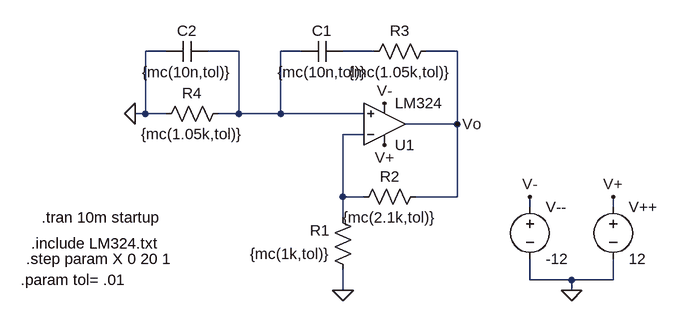
[diagram p0: schematic Lab4Circ2.asc]
Lab4Circ2.asc, the LTspice schematic file:
Version 4
SHEET 1 1424 680
WIRE -128 48 -160 48
WIRE -16 48 -64 48
WIRE 80 48 48 48
WIRE 192 48 144 48
WIRE 320 48 272 48
WIRE -160 144 -160 48
WIRE -160 144 -176 144
WIRE -128 144 -160 144
WIRE -16 144 -16 48
WIRE -16 144 -48 144
WIRE 48 144 48 48
WIRE 48 144 -16 144
WIRE 176 144 48 144
WIRE 320 160 320 48
WIRE 320 160 240 160
WIRE 176 176 144 176
WIRE 144 272 144 176
WIRE 176 272 144 272
WIRE 320 272 320 160
WIRE 320 272 256 272
WIRE 432 288 432 272
WIRE 560 288 560 272
WIRE 144 304 144 272
WIRE 432 400 432 368
WIRE 496 400 432 400
WIRE 560 400 560 368
WIRE 560 400 496 400
WIRE 144 416 144 384
WIRE 496 416 496 400
FLAG 496 416 0
FLAG 560 272 V+
FLAG 208 192 V+
FLAG 432 272 V-
FLAG 208 128 V-
FLAG 320 160 Vo
FLAG 144 416 0
FLAG -176 144 0
SYMBOL AutoGenerated\\LM324 208 224 M180
SYMATTR InstName U1
SYMBOL voltage 560 272 R0
WINDOW 123 0 0 Left 0
WINDOW 39 24 124 Left 2
SYMATTR InstName V++
SYMATTR Value 12
SYMBOL voltage 432 272 R0
WINDOW 123 0 0 Left 0
WINDOW 39 24 124 Left 2
SYMATTR InstName V--
SYMATTR Value -12
SYMBOL res 272 256 R90
WINDOW 0 0 56 VBottom 2
WINDOW 3 32 56 VTop 2
SYMATTR InstName R2
SYMATTR Value {mc(2.1k,tol)}
SYMBOL res 288 32 R90
WINDOW 0 0 56 VBottom 2
WINDOW 3 32 56 VTop 2
SYMATTR InstName R3
SYMATTR Value {mc(1.05k,tol)}
SYMBOL res 160 400 R180
WINDOW 0 36 76 Left 2
WINDOW 3 36 40 Left 2
SYMATTR InstName R1
SYMATTR Value {mc(1k,tol)}
SYMBOL cap 144 32 R90
WINDOW 0 0 32 VBottom 2
WINDOW 3 32 32 VTop 2
SYMATTR InstName C1
SYMATTR Value {mc(10n,tol)}
SYMBOL res -32 128 R90
WINDOW 0 0 56 VBottom 2
WINDOW 3 32 56 VTop 2
SYMATTR InstName R4
SYMATTR Value {mc(1.05k,tol)}
SYMBOL cap -64 32 R90
WINDOW 0 0 32 VBottom 2
WINDOW 3 32 32 VTop 2
SYMATTR InstName C2
SYMATTR Value {mc(10n,tol)}
TEXT -336 344 Left 2 !.include LM324.txt
TEXT -320 304 Left 2 !.tran 10m startup
TEXT -352 400 Left 2 !.param tol= .01
TEXT -344 368 Left 2 !.step param X 0 20 1

The netlist it stands for:
* Lab4Circ2.asc
* U1: LM324 (symbol AutoGenerated\LM324 not available, pins judged from their places): In+=N001 In-=N003 V+=V+ V-=V- OUT=Vo
V++ V+ 0 12
V-- V- 0 -12
R2 Vo N003 {mc(2.1k,tol)}
R3 Vo N002 {mc(1.05k,tol)}
R1 0 N003 {mc(1k,tol)}
C1 N002 N001 {mc(10n,tol)}
R4 N001 0 {mc(1.05k,tol)}
C2 N001 0 {mc(10n,tol)}
.include LM324.txt
.tran 10m startup
.param tol= .01
.step param X 0 20 1
.backanno
.end